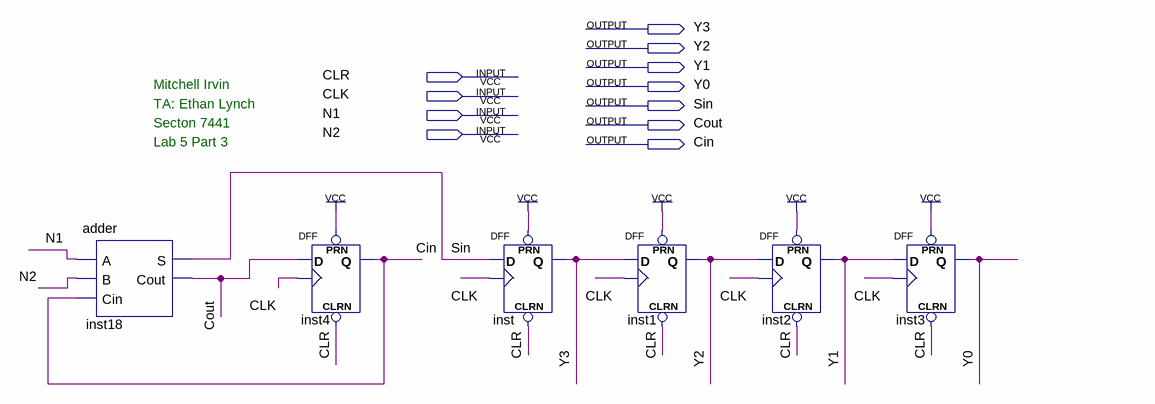
[diagram p0: schematic sheet]
// Quartus schematic lab5part3.bdf as structural Verilog: 6 symbols, 11 pins
module lab5part3 (
  input  CLR,
  input  CLK,
  input  N1,
  input  N2,
  output Y3,
  output Y2,
  output Y1,
  output Y0,
  output Sin,
  output Cout,
  output Cin
);

  adder inst18 (.A(N1), .B(N2), .Cin(Cin), .S(Sin), .Cout(Cout));
  DFF inst4 (.CLRN(CLR), .CLK(CLK), .D(Cout), .PRN(1'b1), .Q(Cin));
  DFF inst (.CLRN(CLR), .CLK(CLK), .D(Sin), .PRN(1'b1), .Q(Y3));
  DFF inst1 (.CLRN(CLR), .CLK(CLK), .D(Y3), .PRN(1'b1), .Q(Y2));
  DFF inst2 (.CLRN(CLR), .CLK(CLK), .D(Y2), .PRN(1'b1), .Q(Y1));
  DFF inst3 (.CLRN(CLR), .CLK(CLK), .D(Y1), .PRN(1'b1), .Q(Y0));

  // Notes on the sheet:
  //   Mitchell Irvin
  //   TA: Ethan Lynch
  //   Secton 7441
  //   Lab 5 Part 3
endmodule
